# Altium project XSS_MiniFOC_V1.PrjPcb
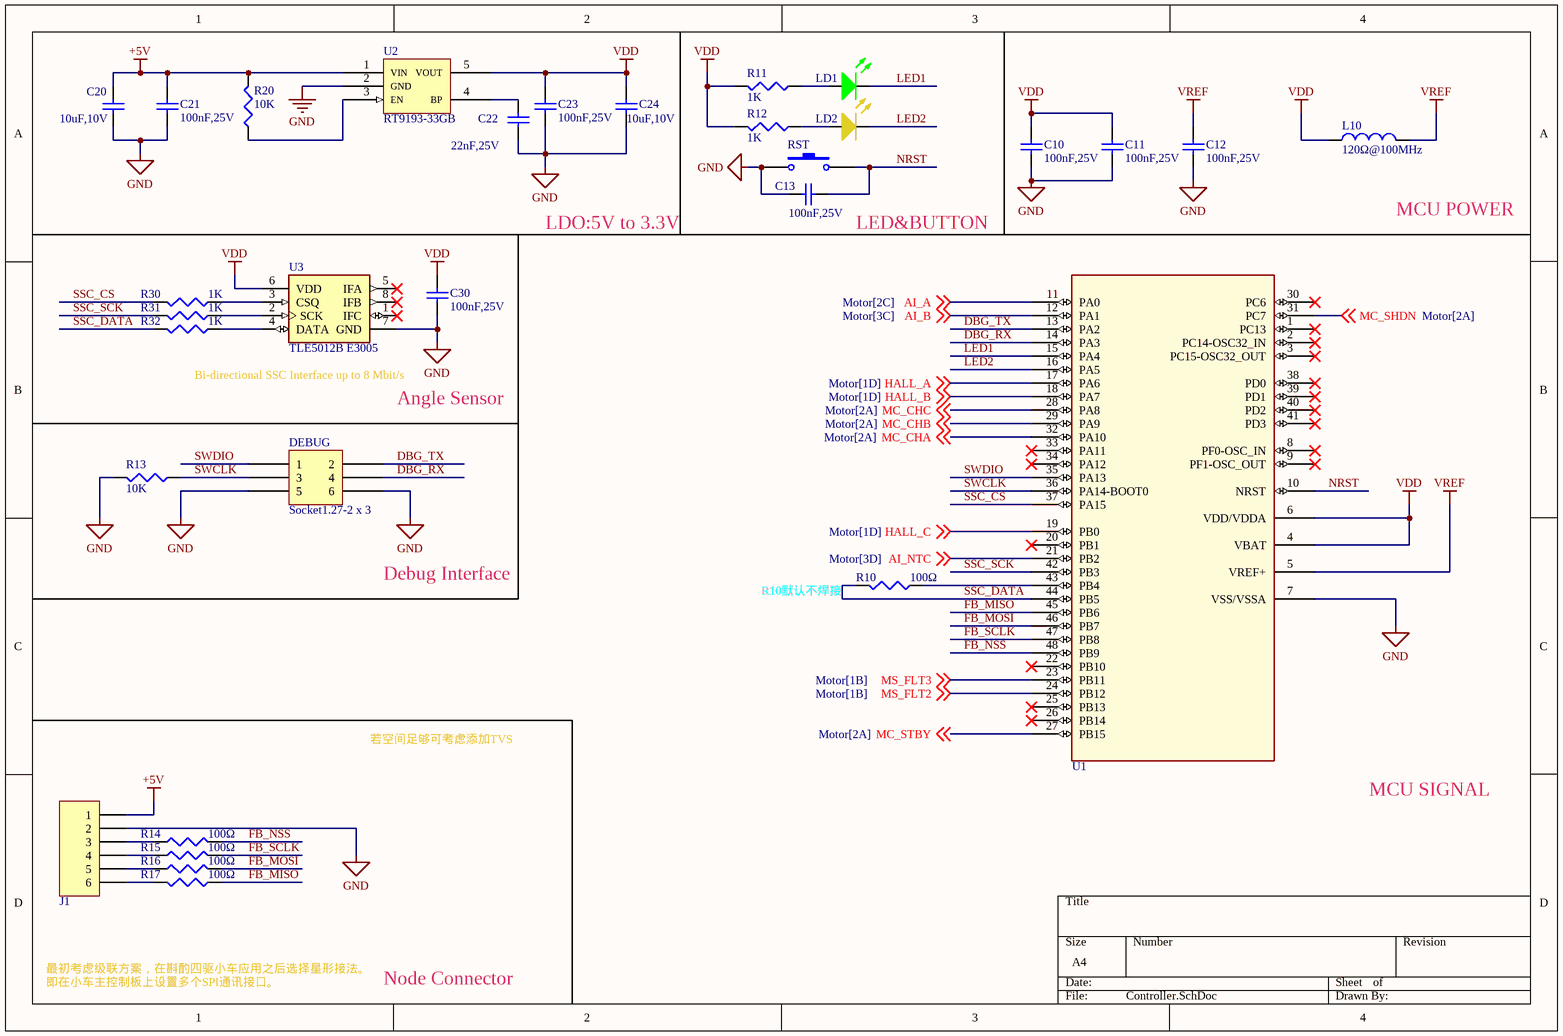
[diagram p0: Controller.SchDoc]
2 sheets, 72 parts. Net scope: global (net labels, ports and power ports of the same name join across sheets).
Board file: MiniFOC_G070C_4Layer.PcbDoc
Sheets:
  Controller.SchDoc
  Motor.SchDoc

## Sheet Controller.SchDoc
size A4; SheetNumber: 1; SheetTotal: 2

### Parts
C10  value 100nF,25V  [CAPC1005L]  (hidden comment: MLCC)
C11  value 100nF,25V  [CAPC1005L]  (hidden comment: MLCC)
C12  value 100nF,25V  [CAPC1005L]  (hidden comment: MLCC)
C13  value 100nF,25V  [CAPC1005L]  (hidden comment: MLCC)
C20  value 10uF,10V  [CAPC1608L]  (hidden comment: MLCC)
C21  value 100nF,25V  [CAPC1005L]  (hidden comment: MLCC)
C22  value 22nF,25V  [CAPC1005L]  (hidden comment: MLCC)
C23  value 100nF,25V  [CAPC1005L]  (hidden comment: MLCC)
C24  value 10uF,10V  [CAPC1608L]  (hidden comment: MLCC)
C30  value 100nF,25V  [CAPC1005L]  (hidden comment: MLCC)
DEBUG  Socket1.27-2 x 3  [Socket_1.27_V_2 x 03]
J1  B6B-PH-K-S  [B6B-PH-K-S]  (value not drawn)
L10  value 120Ω@100MHz  [0402-A]  (hidden comment: Inductor)
LD1  LED_0603_GREEN  [LED_0603_AK_Green]  (value not drawn)
LD2  LED  [LED_0603_AK_Yellow]  (value not drawn)
R10  value 100Ω  [RESC1005L]  (hidden comment: RES, SMT)
R11  value 1K  [RESC1005L]  (hidden comment: RES, SMT)
R12  value 1K  [RESC1005L]  (hidden comment: RES, SMT)
R13  value 10K  [RESC1005L]  (hidden comment: RES, SMT)
R14  value 100Ω  [RESC1005L]  (hidden comment: RES, SMT)
R15  value 100Ω  [RESC1005L]  (hidden comment: RES, SMT)
R16  value 100Ω  [RESC1005L]  (hidden comment: RES, SMT)
R17  value 100Ω  [RESC1005L]  (hidden comment: RES, SMT)
R20  value 10K  [RESC1005L]  (hidden comment: RES, SMT)
R30  value 1K  [RESC1005L]  (hidden comment: RES, SMT)
R31  value 1K  [RESC1005L]  (hidden comment: RES, SMT)
R32  value 1K  [RESC1005L]  (hidden comment: RES, SMT)
RST  switch  [SW2_3*2*0.6]  (value not drawn)
U1  STM32G070CBT6  [LQFP48-L]  (value not drawn)
U2  RT9193-33GB  [SOT-25]
U3  TLE5012B E3005  [Infineon_PG-DSO-8]

### Nets
+5V: C20.2 C21.2 J1.1 R20.2 U2.1(VIN)
GND: C10.1 C11.1 C12.1 C13.2 C20.1 C21.1 C22.1 C23.1 C24.1 C30.1 DEBUG.5 DEBUG.6 J1.2 R13.2 RST.1 U1.7(VSS/VSSA) U2.2(GND) U3.7(GND)
VDD: C10.2 C11.2 C23.2 C24.2 C30.2 L10.2 R11.2 R12.2 U1.4(VBAT) U1.6(VDD/VDDA) U2.5(VOUT) U3.6(VDD)
VREF: C12.2 L10.1 U1.5(VREF+)
AI_A: U1.11(PA0) ; off-sheet AI_A
AI_B: U1.12(PA1) ; off-sheet AI_B
AI_NTC: U1.21(PB2) ; off-sheet AI_NTC
DBG_RX: DEBUG.4 U1.14(PA3)
DBG_TX: DEBUG.2 U1.13(PA2)
FB_MISO: R17.1 U1.45(PB6)
FB_MOSI: R16.2 U1.46(PB7)
FB_NSS: R14.2 U1.48(PB9)
FB_SCLK: R15.2 U1.47(PB8)
HALL_A: U1.17(PA6) ; off-sheet HALL_A
HALL_B: U1.18(PA7) ; off-sheet HALL_B
HALL_C: U1.19(PB0) ; off-sheet HALL_C
LED1: LD1.K U1.15(PA4)
LED2: LD2.K U1.16(PA5)
MC_CHA: U1.32(PA10) ; off-sheet MC_CHA
MC_CHB: U1.29(PA9) ; off-sheet MC_CHB
MC_CHC: U1.28(PA8) ; off-sheet MC_CHC
MC_SHDN: U1.31(PC7) ; off-sheet MC_SHDN
MC_STBY: U1.27(PB15) ; off-sheet MC_STBY
MS_FLT2: U1.24(PB12) ; off-sheet MS_FLT2
MS_FLT3: U1.23(PB11) ; off-sheet MS_FLT3
NRST: C13.1 RST.2 U1.10(NRST)
SSC_CS: R30.2 U1.37(PA15)
SSC_DATA: R10.2 R32.2 U1.44(PB5)
SSC_SCK: R31.2 U1.42(PB3)
SWCLK: DEBUG.3 R13.1 U1.36(PA14-BOOT0)
SWDIO: DEBUG.1 U1.35(PA13)
NetC22_2: C22.2 U2.4(BP)
NetJ1_3: J1.3 R14.1
NetJ1_4: J1.4 R15.1
NetJ1_5: J1.5 R16.1
NetJ1_6: J1.6 R17.2
NetLD1_A: LD1.A R11.1
NetLD2_A: LD2.A R12.1
NetR10_1: R10.1 U1.43(PB4)
NetR20_1: R20.1 U2.3(EN)
NetR30_1: R30.1 U3.3(CSQ)
NetR31_1: R31.1 U3.2(SCK)
NetR32_1: R32.1 U3.4(DATA)

Not connected (* = marked no-connect by the designer): U1 1(PC13)* 2(PC14-OSC32_IN)* 3(PC15-OSC32_OUT)* 8(PF0-OSC_IN)* 9(PF1-OSC_OUT)* 20(PB1)* 22(PB10)* 25(PB13)* 26(PB14)* 30(PC6)* 33(PA11)* 34(PA12)* 38(PD0)* 39(PD1)* 40(PD2)* 41(PD3)*; U3 1(IFC)* 5(IFA)* 8(IFB)*

### Notes on the sheet
- LDO:5V to 3.3V
- LED&BUTTON
- MCU POWER
- Bi-directional SSC Interface up to 8 Mbit/s
- Angle Sensor
- Debug Interface
- R10默认不焊接
- 若空间足够可考虑添加TVS
- MCU SIGNAL
- 最初考虑级联方案，在斟酌四驱小车应用之后选择星形接法。
- 即在小车主控制板上设置多个SPI通讯接口。
- Node Connector

### Library data of the parts
C10-C13 C21-C23 C30 = Cap: MLCC, 0402(1005); Published: 8-Jun-2000; LatestRevisionDate: 17-Jul-2002; LatestRevisionNote: Re-released for DXP Platform.; PackageReference: RAD-0.3; Publisher: Altium Limited; PackageDescription: Radial Cap, Thru-Hole; 2 Leads; 0.3 in Pin Spacing
C20 C24 = Cap: MLCC, 0603(1608); Published: 8-Jun-2000; LatestRevisionDate: 17-Jul-2002; LatestRevisionNote: Re-released for DXP Platform.; PackageReference: RAD-0.3; Publisher: Altium Limited; PackageDescription: Radial Cap, Thru-Hole; 2 Leads; 0.3 in Pin Spacing
DEBUG = Socket1.27-3x2: Socket with 1.27mm gap, 3x2 pins
J1 = B6B-PH-K-S: B6B-PH-K-S or PH2.0 vertical throughhole,5 pins,Gap:2mm
L10 = Inductor: Ferrite Bead; Code_IEC: 1005; Published: 8-Jun-2000; LatestRevisionDate: 29-May-2009; LatestRevisionNote: IPC-7351 Footprint Added.; PackageReference: 0402-A; Publisher: Altium Limited; PackageDescription: Chip Inductor; Code_JEITA: 0402
LD1 = LED_0603_GREEN: GREEN LED, 0603
LD2 = LED_0603_YELLOW: YELLOW LED, 0603
R10-R17 R20 R30-R32 = Res3: Resistor, 0402(1005); Published: 8-Jun-2000; LatestRevisionDate: 29-May-2009; LatestRevisionNote: IPC-7351 Footprint Added.; PackageReference: J1-0603; Publisher: Altium Limited; PackageDescription: Chip Resistor
RST = SW-SPST-2P
U1 = STM32G070CBTx: The STM32G070CB/KB/RB mainstream microcontrollers are based on high-performance Arm® Cortex®-M0+ 32-bit RISC core operating at up to 64 MHz frequency. / 128 Kbytes of Flash program memory and 36 Kbytes of SRAM. With 48pin LQFP 7x7x1.4 package; Manufacturer_Part_Number: stm32g0_lqfp48_t2; Vendor: STMicroelectronics; Copyright: Copyright (C) 2018 Accelerated Designs. All rights reserved; RefDes: RefDes; Type: DEV; Value: Value
U2 = RT9193-xxGB: RICHTEK RT9193-xxGB with SOT-23-5. xx could be 15...50(1.5V...5.0V),1H(1.85V),2H(2.85V),4G(4.75V).; ComponentLink1Description: Datasheet; ComponentLink1URL: https://www.richtek.com/assets/product_file/RT9193/DS9193-17.pdf; ComponentLink2Description: Website; ComponentLink2URL: https://www.richtek.com/Products/Linear%20Regulator/Single%20Output%20Linear%20Regulator/RT9193?sc_lang=en
U3 = TLE5012B: Infineon, TLE5012B magnetic angle sensor for steering angle measurement. SOIC-8(PG-DSO-8) package.

## Sheet Motor.SchDoc
size A4; SheetNumber: 2; SheetTotal: 2
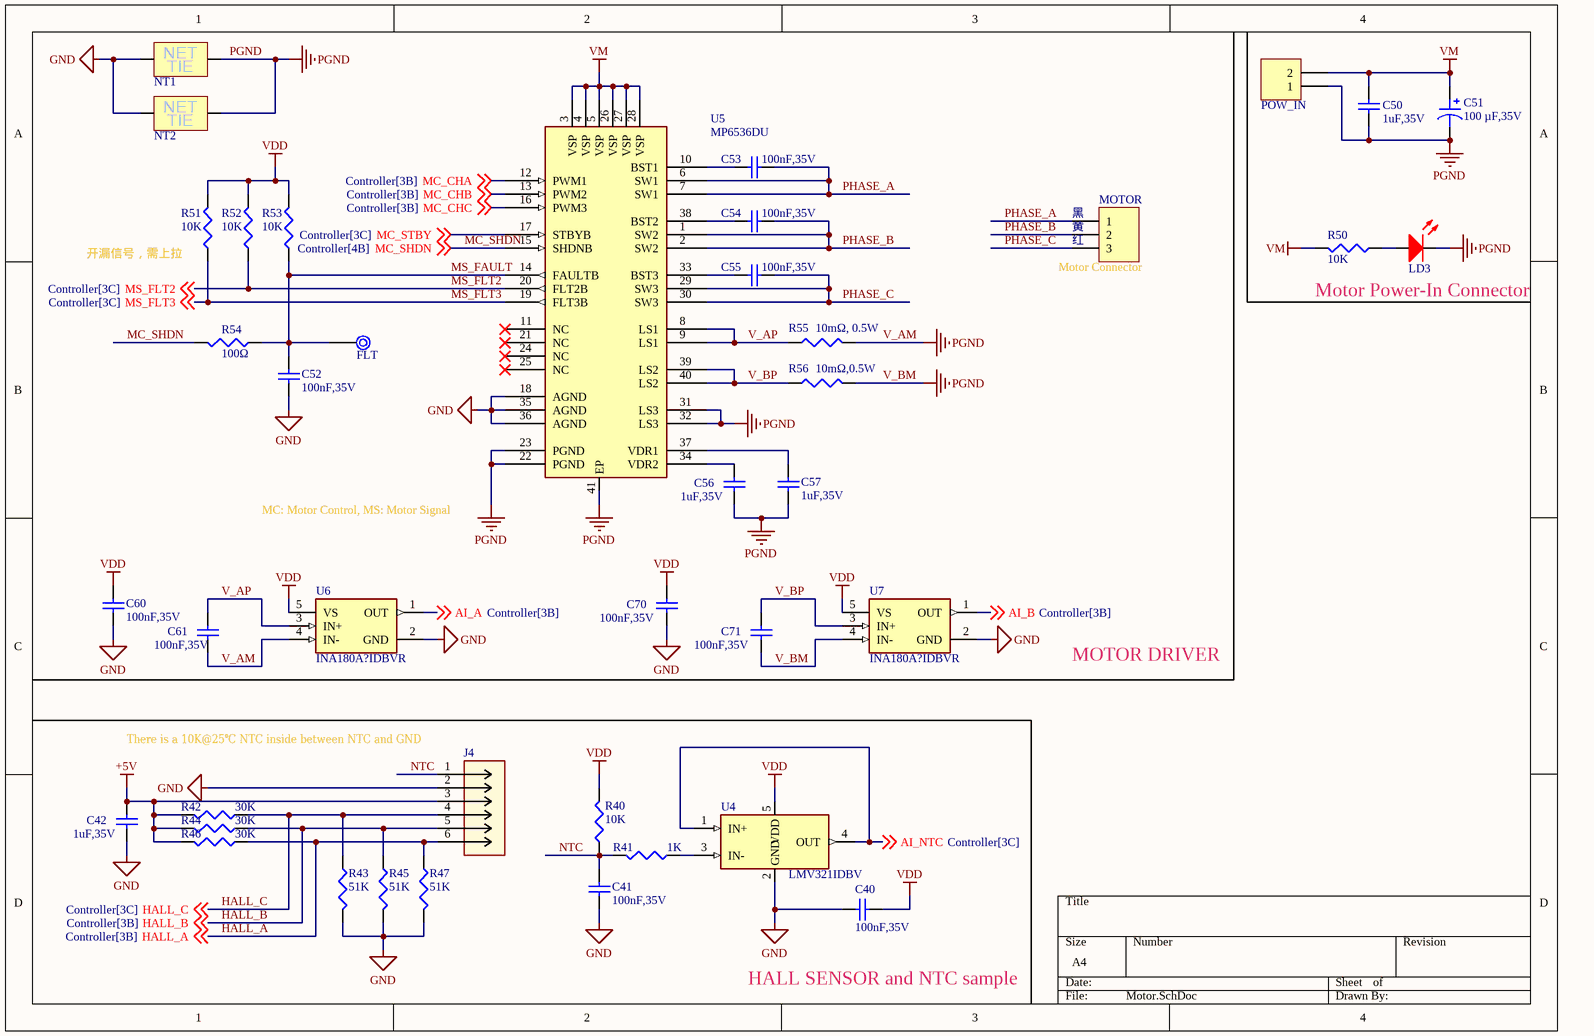
[diagram p1: Motor.SchDoc]

### Parts
C40  value 100nF,35V  [CAPC1005L]  (hidden comment: MLCC)
C41  value 100nF,35V  [CAPC1005L]  (hidden comment: MLCC)
C42  value 1uF,35V  [CAPC1608L]  (hidden comment: MLCC)
C50  value 1uF,35V  [CAPC1608L]  (hidden comment: MLCC)
C51  100 µF,35V  [CAP ALSMD 6.6MM H7.7MM]
C52  value 100nF,35V  [CAPC1005L]  (hidden comment: MLCC)
C53  value 100nF,35V  [CAPC1005L]  (hidden comment: MLCC)
C54  value 100nF,35V  [CAPC1005L]  (hidden comment: MLCC)
C55  value 100nF,35V  [CAPC1005L]  (hidden comment: MLCC)
C56  value 1uF,35V  [CAPC1608L]  (hidden comment: MLCC)
C57  value 1uF,35V  [CAPC1608L]  (hidden comment: MLCC)
C60  value 100nF,35V  [CAPC1005L]  (hidden comment: MLCC)
C61  value 100nF,35V  [CAPC1005L]  (hidden comment: MLCC)
C70  value 100nF,35V  [CAPC1005L]  (hidden comment: MLCC)
C71  value 100nF,35V  [CAPC1005L]  (hidden comment: MLCC)
FLT  Test Point  [TPSMD-Small]  (value not drawn)
J4  530470610  [MOLEX_PicoBlade_53047-0610]  (value not drawn)
LD3  LED  [LED_0603_AK_Red]  (value not drawn)
MOTOR  B3B-XH-A  [B3B-XH-A]  (value not drawn)
NT1  Net Tie  [NET-TIE-50MIL-Block]  (value not drawn)  (net tie, no BOM)
NT2  Net Tie  [NET-TIE-50MIL-Block]  (value not drawn)  (net tie, no BOM)
POW_IN  5267-02A  [Molex-5267-02a]  (value not drawn)
R40  value 10K  [RESC1005L]  (hidden comment: RES, SMT)
R41  value 1K  [RESC1005L]  (hidden comment: RES, SMT)
R42  value 30K  [RESC1005L]  (hidden comment: RES, SMT)
R43  value 51K  [RESC1005L]  (hidden comment: RES, SMT)
R44  value 30K  [RESC1005L]  (hidden comment: RES, SMT)
R45  value 51K  [RESC1005L]  (hidden comment: RES, SMT)
R46  value 30K  [RESC1005L]  (hidden comment: RES, SMT)
R47  value 51K  [RESC1005L]  (hidden comment: RES, SMT)
R50  value 10K  [RESC1005L]  (hidden comment: RES, SMT)
R51  value 10K  [RESC1005L]  (hidden comment: RES, SMT)
R52  value 10K  [RESC1005L]  (hidden comment: RES, SMT)
R53  value 10K  [RESC1005L]  (hidden comment: RES, SMT)
R54  value 100Ω  [RESC1005L]  (hidden comment: RES, SMT)
R55  value 10mΩ, 0.5W  [RESC2012L]  (hidden comment: RES, SMT)
R56  value 10mΩ,0.5W  [RESC2012L]  (hidden comment: RES, SMT)
U4  LMV321IDBV  [TI_DBV0005A]
U5  MP6536DU  [QFN40-5x5_MP6536]
U6  INA180A?IDBVR  [TI_DBV0005A]
U7  INA180A?IDBVR  [TI_DBV0005A]

### Nets
+5V: C42.1 J4.3 R42.2 R44.2 R46.2
GND: C40.1 C41.2 C42.2 C52.2 C60.2 C70.2 J4.2 NT1.1(AG) NT2.1(AG) R43.2 R45.2 R47.2 U4.2(GND) U5.18(AGND) U5.35(AGND) U5.36(AGND) U6.2(GND) U7.2(GND)
PGND: C50.1 C51.2 C56.2 C57.2 C61.2 C71.2 LD3.K NT1.2(G) NT2.2(G) POW_IN.1 R55.2 R56.2 U5.22(PGND) U5.23(PGND) U5.31(LS3) U5.32(LS3) U5.41(EP) U6.4(IN-) U7.4(IN-)  [also labelled V_AM, V_BM]
VDD: C40.2 C60.1 C70.1 R40.2 R51.2 R52.2 R53.2 U4.5(VDD) U6.5(VS) U7.5(VS)
VM: C50.2 C51.1 POW_IN.2 R50.2 U5.3(VSP) U5.4(VSP) U5.5(VSP) U5.26(VSP) U5.27(VSP) U5.28(VSP)
AI_A: U6.1(OUT) ; off-sheet AI_A
AI_B: U7.1(OUT) ; off-sheet AI_B
AI_NTC: U4.1(IN+) U4.4(OUT) ; off-sheet AI_NTC
HALL_A: J4.6 R46.1 R47.1 ; off-sheet HALL_A
HALL_B: J4.5 R44.1 R45.1 ; off-sheet HALL_B
HALL_C: J4.4 R42.1 R43.1 ; off-sheet HALL_C
MC_CHA: U5.12(PWM1) ; off-sheet MC_CHA
MC_CHB: U5.13(PWM2) ; off-sheet MC_CHB
MC_CHC: U5.16(PWM3) ; off-sheet MC_CHC
MC_SHDN: R54.2 U5.15(SHDNB) ; off-sheet MC_SHDN
MC_STBY: U5.17(STBYB) ; off-sheet MC_STBY
MS_FAULT: C52.1 FLT.1 R53.1 R54.1 U5.14(FAULTB)
MS_FLT2: R52.1 U5.20(FLT2B) ; off-sheet MS_FLT2
MS_FLT3: R51.1 U5.19(FLT3B) ; off-sheet MS_FLT3
NTC: C41.1 J4.1 R40.1 R41.2
PHASE_A: C53.1 MOTOR.1 U5.6(SW1) U5.7(SW1)
PHASE_B: C54.1 MOTOR.2 U5.1(SW2) U5.2(SW2)
PHASE_C: C55.1 MOTOR.3 U5.29(SW3) U5.30(SW3)
V_AP: C61.1 R55.1 U5.8(LS1) U5.9(LS1) U6.3(IN+)
V_BP: C71.1 R56.1 U5.39(LS2) U5.40(LS2) U7.3(IN+)
NetC53_2: C53.2 U5.10(BST1)
NetC54_2: C54.2 U5.38(BST2)
NetC55_2: C55.2 U5.33(BST3)
NetC56_1: C56.1 U5.34(VDR2)
NetC57_1: C57.1 U5.37(VDR1)
NetLD3_A: LD3.A R50.1
NetR41_1: R41.1 U4.3(IN-)

Not connected (* = marked no-connect by the designer): U5 11(NC)* 21(NC)* 24(NC)* 25(NC)*

### Notes on the sheet
- (near MOTOR) 黑
- (near MOTOR) 黄
- (near MOTOR) 红
- 开漏信号，需上拉
- (near MOTOR) Motor Connector
- Motor Power-In Connector
- MC: Motor Control, MS: Motor Signal
- MOTOR DRIVER
- There is a 10K@25℃ NTC inside between NTC and GND
- HALL SENSOR and NTC sample
- (in symbol NET-TIE-GROUND) NET; TIE

### Library data of the parts
C40 C41 C52-C55 C60 C61 C70 C71 = Cap: MLCC, 0402(1005); Published: 8-Jun-2000; LatestRevisionDate: 17-Jul-2002; LatestRevisionNote: Re-released for DXP Platform.; PackageReference: RAD-0.3; Publisher: Altium Limited; PackageDescription: Radial Cap, Thru-Hole; 2 Leads; 0.3 in Pin Spacing
C42 C50 C56 C57 = Cap: MLCC, 0603(1608); Published: 8-Jun-2000; LatestRevisionDate: 17-Jul-2002; LatestRevisionNote: Re-released for DXP Platform.; PackageReference: RAD-0.3; Publisher: Altium Limited; PackageDescription: Radial Cap, Thru-Hole; 2 Leads; 0.3 in Pin Spacing
C51 = EEE-1VA101XAP: CAP ALUM 100UF 20% 35V SMD; manufacturer: Panasonic Electronic Components; Capacitance: 100 µF; Lifetime @ Temp.: 2000 Hrs @ 85°C; Polarization: Polar; Ripple Current @ High Frequency: 224.4 mA @ 10 kHz; Ripple Current @ Low Frequency: 132 mA @ 120 Hz; Surface Mount Land Size: 0.260" L x 0.260" W (6.60mm x 6.60mm); Part Number: EEE-1VA101XAP; Applications: Automotive; componentlink1description: Datasheet; componentlink1url: https://industrial.panasonic.com/cdbs/www-data/pdf/RDE0000/ABA0000C1142.pdf; componentlink2description: DigiKey Link; componentlink2url: https://www.digikey.com/en/products/detail/panasonic-electronic-components/EEE-1VA101XAP/1717799; Device Package: Radial, Can - SMD; Height - Seated (Max): 0.303" (7.70mm); lastupdated: 2023/1/24 22:26:09; Lifecycle Status: Active; Minimum Order: 1; Mounting Type: Surface Mount; Operating Temperature: -40°C ~ 85°C; Package / Case: Radial, Can - SMD; packaging: TapeAndReel; partid: 27502; Part Status: Active; price: 0.18; Ratings: AEC-Q200; series: S; Size / Dimension: 0.248" Dia (6.30mm); Supplier 1: DigiKey; Supplier Part Number 1: PCE4633CT-ND; Tolerance: ±20%; value: 100 µF,35V; Voltage - Rated: 35 V
FLT = TestPoint
J4 = MOLEX_PicoBlade_53047-0610: MOLEX, PicoBlade Header with 1.25mm gap distance, 53047-0610, Through hole, Vertical type with 6 Circuit.
LD3 = LED_0603_RED: RED LED, 0603
MOTOR = B3B-XH-A: JST XH Series, Pitch 2.5mm, Top Entry, 3Pins
NT1 NT2 = NET-TIE-GROUND
POW_IN = Molex-5267-02A: 2.50mm Pitch, Mini-SPOX PCB Header, Single Row, Vertical, Through Hole, Tin Plating, 2 Circuits, Bag, 3.50mm PC Tail Length
R40-R47 R50-R54 = Res3: Resistor, 0402(1005); Published: 8-Jun-2000; LatestRevisionDate: 29-May-2009; LatestRevisionNote: IPC-7351 Footprint Added.; PackageReference: J1-0603; Publisher: Altium Limited; PackageDescription: Chip Resistor
R55 R56 = Res3: Resistor, 0805(2012); Published: 8-Jun-2000; LatestRevisionDate: 29-May-2009; LatestRevisionNote: IPC-7351 Footprint Added.; PackageReference: J1-0603; Publisher: Altium Limited; PackageDescription: Chip Resistor
U4 = LMV321IDBV: LMV321, Single, 5.5-V, 1-MHz, RRO operational amplifier, SOT-23-5(DBV) package
U5 = MP6536DU: MPS, MP6536DU-LF-P/Z, 26V, 5.5A, 3-Channel Half-Bridge Driver, QFN40 5mmx5mm package
U6 U7 = INA180A?IDBVR: TI, 26V, 350kHz current sense amplifier, 1 Channel, DBV Package

## Nets that join several sheets
+5V: Controller (5 pins), Motor (5 pins)
GND: Controller (18 pins), Motor (18 pins)
VDD: Controller (12 pins), Motor (10 pins)
AI_A: Controller (U1.11), Motor (U6.1)
AI_B: Controller (U1.12), Motor (U7.1)
AI_NTC: Controller (U1.21), Motor (U4.1 U4.4)
HALL_A: Controller (U1.17), Motor (J4.6 R46.1 R47.1)
HALL_B: Controller (U1.18), Motor (J4.5 R44.1 R45.1)
HALL_C: Controller (U1.19), Motor (J4.4 R42.1 R43.1)
MC_CHA: Controller (U1.32), Motor (U5.12)
MC_CHB: Controller (U1.29), Motor (U5.13)
MC_CHC: Controller (U1.28), Motor (U5.16)
MC_SHDN: Controller (U1.31), Motor (R54.2 U5.15)
MC_STBY: Controller (U1.27), Motor (U5.17)
MS_FLT2: Controller (U1.24), Motor (R52.1 U5.20)
MS_FLT3: Controller (U1.23), Motor (R51.1 U5.19)